# EAGLE design 3wire-1602-panel (EAGLE 5.07)
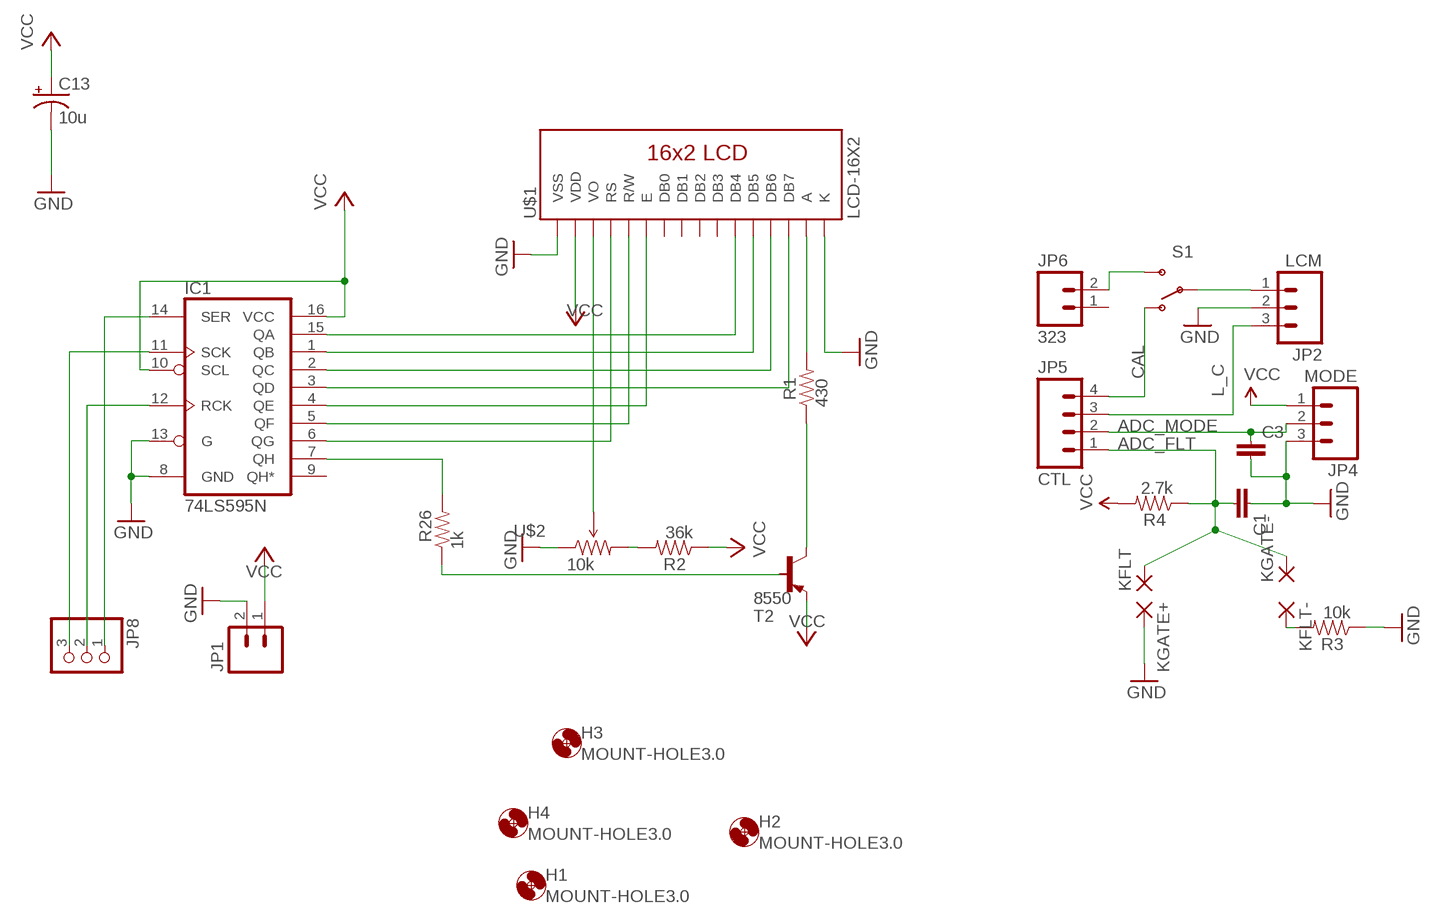
[diagram p0: schematic, sheet 1]

## Parts
C1  CAPPTH1  [CAP-PTH-5MM]
C3  CAPPTH1  [CAP-PTH-5MM]
C13  10u  CAP_POL1206  [EIA3216]
H1  MOUNT-HOLE3.0  [3,0]
H2  MOUNT-HOLE3.0  [3,0]
H3  MOUNT-HOLE3.0  [3,0]
H4  MOUNT-HOLE3.0  [3,0]
IC1  74LS595N  [DIL16]
JP1  CON-02-XH  [XH-1X2-LONG-LOCK]
JP2  LCM  M03LOCK_LONGPADS  [1X03_LOCK_LONGPADS]
JP4  MODE  M03LOCK_LONGPADS  [1X03_LOCK_LONGPADS]
JP5  CTL  M04LOCK_LONGPADS  [1X04_LOCK_LONGPADS]
JP6  323  CON-02LOCK_LONGPADS  [1X02_LOCK_LONGPADS]
JP8  PINHD-1X3/90-LOCK  [1X03/90_LOCK]
KFLT  3,81/1,4  [3,81/1,4]
KFLT-  3,81/1,4  [3,81/1,4]
KGATE+  3,81/1,4  [3,81/1,4]
KGATE-  3,81/1,4  [3,81/1,4]
R1  430  RESISTOR1/4W  [AXIAL-0.3]
R2  36k  RESISTOR1/4W  [AXIAL-0.3]
R3  10k  RESISTOR1/4W  [AXIAL-0.3]
R4  2.7k  RESISTOR1/4W  [AXIAL-0.3]
R26  1k  RESISTOR1/4W  [AXIAL-0.3]
S1  SWITCH-SPST3AM6  [SWITCH-SPDT-AM#6]
T2  8550  -PNP-TO92-EBC  [TO92-EBC]
U$1  LCD-16X2  LCD-16X2-STD  [LCD-16X2]
U$2  10k  TRIMPOTPTH  [TRIM_POT_PTH]

## Nets
ADC_FLT: C1.2 JP5.1 KFLT.1(P) KGATE-.1(P) R4.P$1
ADC_MODE: C3.1 JP4.2 JP5.2
CAL: JP5.4 S1.1(O)
GND: C1.1 C3.2 C13.C(-) IC1.8(GND) IC1.13(G) JP1.2 JP2.2 JP4.3 KGATE+.1(P) R3.P$1 U$1.1(VSS) U$1.16(K) U$2.1(CCW)
L_C: JP2.3 JP5.3
N$1: IC1.15(QA) U$1.11(DB4)
N$2: IC1.1(QB) U$1.12(DB5)
N$3: IC1.2(QC) U$1.13(DB6)
N$4: IC1.3(QD) U$1.14(DB7)
N$5: IC1.4(QE) U$1.6(E)
N$6: IC1.5(QF) U$1.5(R/W)
N$7: IC1.6(QG) U$1.4(RS)
N$8: IC1.7(QH) R26.P$2
N$10: IC1.14(SER) JP8.1
N$11: IC1.11(SCK) JP8.3
N$12: JP2.1 S1.2(P)
N$13: IC1.12(RCK) JP8.2
N$14: JP6.2 S1.3(S)
N$15: U$1.3(VO) U$2.2(WIPER)
N$16: R1.P$2 U$1.15(A)
N$17: R2.P$2 U$2.3(CW)
N$19: R1.P$1 T2.C
N$20: KFLT-.1(P) R3.P$2
N$55: R26.P$1 T2.B
VCC: C13.A(+) IC1.10(SCL) IC1.16(VCC) JP1.1 JP4.1 R2.P$1 R4.P$2 T2.E U$1.2(VDD)
Unconnected: IC1.9(QH*) JP6.1 U$1.7(DB0) U$1.8(DB1) U$1.9(DB2) U$1.10(DB3)

## Library data of the parts
C1 C3 = digital-toy:CAP: Capacitor Standard 0603 ceramic capacitor, and 0.1" leaded capacitor.
C13 = SparkFun:CAP_POL: Capacitor Polarized These are standard SMD and PTH capacitors. Normally 10uF, 47uF, and 100uF in electrolytic and tantalum varieties. Always verify the external diameter of the through hole cap, it varies with capacity, voltage, and manufacturer. The EIA devices should be standard.
H1-H4 = holes:MOUNT-HOLE: MOUNTING HOLE with drill center marker
IC1 = SparkFun:74*595: 8-bit SHIFT REGISTER, output latch
JP1 JP6 = digital-toy:CON-02: Header 2 Standard 2-pin 0.1" header. Use with straight break away headers (SKU : PRT-00116), right angle break away headers (PRT-00553), swiss pins (PRT-00743), machine pins (PRT-00117), and female headers (PRT-00115). Molex polarized connector foot print use with SKU : PRT-08233 with associated crimp pins and housings.
JP2 JP4 = digital-toy:M03: Header 3 Standard 3-pin 0.1" header. Use with straight break away headers (SKU : PRT-00116), right angle break away headers (PRT-00553), swiss pins (PRT-00743), machine pins (PRT-00117), and female headers (PRT-00115). Molex polarized connector foot print use with SKU : PRT-08232 with associated crimp pins and housings.
JP5 = SparkFun:M04: Header 4 Standard 4-pin 0.1" header. Use with straight break away headers (SKU : PRT-00116), right angle break away headers (PRT-00553), swiss pins (PRT-00743), machine pins (PRT-00117), and female headers (PRT-00115). Molex polarized connector foot print use with SKU : PRT-08231 with associated crimp pins and housings. 1MM SMD Version SKU: PRT-10208
JP8 = digital-toy:PINHD-1X3: PIN HEADER
KFLT KFLT- KGATE+ KGATE- = wirepad:3,81/1,4: THROUGH-HOLE PAD
R1-R4 R26 = digital-toy:RESISTOR: Resistor Basic schematic elements and footprints for 0603, 1206, and PTH 1/10th watt (small) resistors. digital-toy copy vertical mount of axial-0.3 from rcl.lbr : the 0207/xx 3W resistor: 0617/17, 0617/22, 0617V
S1 = digital-toy:SWITCH-SPST: SPST Switch Simple slide switch. Spark Fun Electronics SKU : COM-00102
T2 = digital-toy:*-PNP-: PNP Transistror
U$1 = digital-toy:LCD-16X2: LCD 1602 1602 STD standard lcd1602 1602 YHDS buy from taobao: DV162B4 S2FBLY-H-DS by hyl digital-toy
U$2 = SparkFun:TRIMPOT

## Board
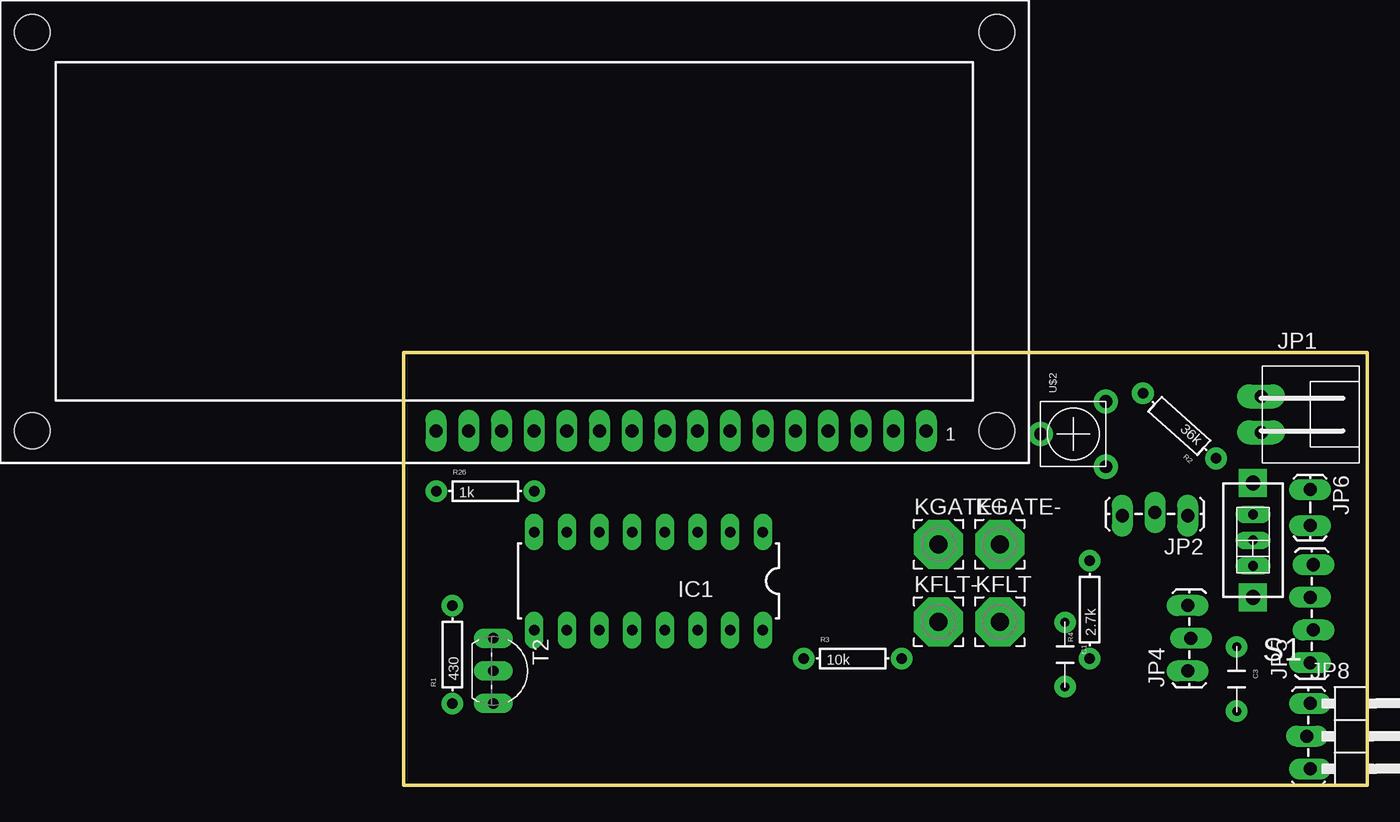
[diagram p1: board, top side]
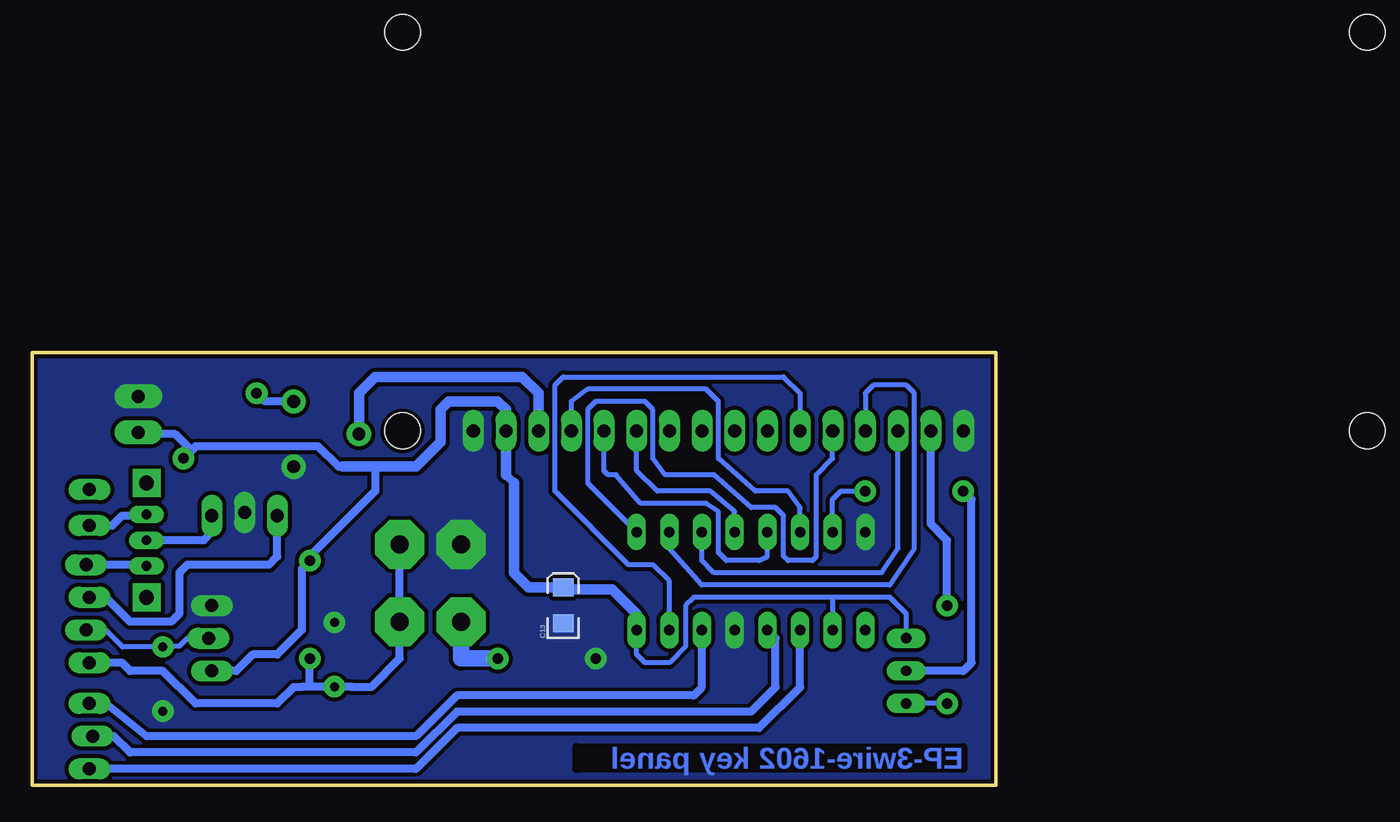
[diagram p2: board, bottom side, seen from below]

Size 74.93 x 33.66 mm. Coordinates in mm from the lower left corner, seen from the top.
Outline: 74.93,0 74.93,33.66 0,33.66 0,0 74.93,0
Copper layers (1*16): Top 0.035mm / dielectric 1.5mm / Bottom 0.035mm
Design rules "SparkFun": minimum track width 8mil, minimum drill 20mil, track to track 8mil, track to pad 8mil, pad to pad 8mil, via to via 8mil, smd to smd 8mil, copper to edge 10mil, drill to drill 8mil, minimum pad ring 12mil, minimum via ring 10mil, stop-mask expansion 4mil, vias tented up to drill 25mil, thermal gap 10mil

### Footprints (pad centres in the part's own frame; a part is rotated, then mirrored left to right if it is on the bottom)
CAP-PTH-5MM = drill 0.7 pad 1.651 round: 1 -2.5,0; 2 2.5,0
EIA3216 = smd 1.4 x 1.6: A 1.4,0; C -1.4,0
3,0 = hole 3: 0,0
DIL16 = drill 0.813 long: 1 -8.89,-3.81; 2 -6.35,-3.81; 3 -3.81,-3.81; 4 -1.27,-3.81; 5 1.27,-3.81; 6 3.81,-3.81; 7 6.35,-3.81; 8 8.89,-3.81; 9 8.89,3.81; 10 6.35,3.81; 11 3.81,3.81; 12 1.27,3.81; 13 -1.27,3.81; 14 -3.81,3.81; 15 -6.35,3.81; 16 -8.89,3.81
XH-1X2-LONG-LOCK = drill 1.016 pad 1.88 long: 1 1.397,0; 2 -1.397,0
1X03_LOCK_LONGPADS = drill 1.016 long: 1 0,0; 2 2.54,-0.254; 3 5.08,0
1X04_LOCK_LONGPADS = drill 1.016 long: 1 0,0; 2 2.54,-0.254; 3 5.08,0; 4 7.62,-0.254
1X02_LOCK_LONGPADS = drill 1.016 long: 1 -0.127,0; 2 2.667,0
1X03/90_LOCK = drill 1.016 long: 1 -2.54,-3.81; 2 0,-4.064; 3 2.54,-3.81
3,81/1,4 = drill 1.397 pad 3.81 octagon: 1 0,0
AXIAL-0.3 = drill 0.813 pad 1.676 round: P$1 -3.81,0; P$2 3.81,0
SWITCH-SPDT-AM#6 = drill 0.762 pad 1.27 long: 1 0,2; 2 0,0; 3 0,-2 | drill 1.15 pad 2.184 square: P$1 0,-4.445; P$2 0,4.445
TO92-EBC = drill 0.813 pad 1.524 long: B 0,-1.27; C 2.54,-1.27; E -2.54,-1.27
LCD-16X2 = drill 1.016 long: 1 -32,15.5; 2 -29.46,15.5; 3 -26.92,15.5; 4 -24.38,15.5; 5 -21.84,15.5; 6 -19.3,15.5; 7 -16.76,15.5; 8 -14.22,15.5; 9 -11.68,15.5; 10 -9.14,15.5; 11 -6.6,15.5; 12 -4.06,15.5; 13 -1.52,15.5; 14 1.02,15.5; 15 3.56,15.5; 16 6.1,15.5 | hole 2.8: -37.5,15.5; -37.5,-15.5; 37.5,15.5; 37.5,-15.5
TRIM_POT_PTH = drill 1 pad 1.88 round: 1 -2.54,-2.54; 2 0,2.54; 3 2.54,-2.54

### Placement (x,y rotation side)
C1  51.44,10.16 270 top
C3  64.77,8.26 270 top
C13  33.66,13.97 90 bottom
H1  0,-20.95 0 top  (outside the outline)
H2  -26.04,-20.95 0 top  (outside the outline)
H3  -17.78,-20.95 0 top  (outside the outline)
H4  -9.53,-20.95 0 top  (outside the outline)
IC1  19.05,15.88 180 top
JP1  66.67,28.83 270 top
JP2  60.96,20.95 180 top
JP4  60.96,8.89 90 top
JP5  70.48,9.53 90 top
JP6  70.48,22.86 270 top
JP8  74.3,3.81 270 top
KFLT  46.35,12.7 0 top
KFLT-  41.59,12.7 0 top
KGATE+  41.59,18.73 0 top
KGATE-  46.35,18.73 0 top
R1  3.81,10.16 90 top
R2  60.33,27.94 138.3 top
R3  34.92,9.84 0 top
R4  53.34,13.65 90 top
R26  6.35,22.86 0 top
S1  66.04,19.05 180 top
T2  8.26,8.89 270 top
U$1  8.64,43.05 180 top
U$2  52.07,27.3 90 top

### Tracks (layer width: path | path; a pad name or v marks a point on that pad's centre or on a via)
ADC_FLT
  Bottom 0.61: 53.34,7.66 C1.2 50.12,7.66 50.09,7.62 48.58,7.62 46.35,9.84 KFLT.1 KGATE-.1 | 53.34,7.66 53.94,7.66 53.98,7.62 54.61,7.62 55.88,6.35 62.23,6.35 64.77,8.89 67.31,8.89 67.94,9.53 JP5.1 | 53.34,7.66 R4.P$1
ADC_MODE
  Bottom 0.406: JP4.2 62.87,11.43 63.5,10.79 64.73,10.79 C3.1 67.91,10.76 69.22,12.06 JP5.2
CAL
  Bottom 0.406: S1.1 66.14,17.14
  Bottom 0.61: 66.14,17.14 JP5.4
GND
  pour Bottom (isolate 0.305, no thermals): -4.45,40.64 62.23,40.64 93.34,37.47 102.23,6.35 81.92,-5.71 -6.99,-6.35 -11.43,-1.91 -11.43,33.66
L_C
  Bottom 0.61: JP5.3 69.22,14.61 67.31,12.7 64.14,12.7 63.5,13.34 63.5,16.51 62.87,17.14 56.52,17.14 55.88,17.78 JP2.3
N$1
  Bottom 0.406: IC1.15 25.4,15.88 26.67,17.14 28.57,17.14 34.29,22.86 34.29,31.11 33.66,31.75 16.51,31.75 15.24,30.48 15.24,28.19 U$1.11
N$2
  Bottom 0.254: 12.7,28.18 U$1.12
  Bottom 0.406: IC1.1 31.75,23.5 31.75,29.21 31.11,29.84 27.3,29.84 26.67,29.21 26.67,25.4 25.72,24.13 21.91,24.13 19.05,21.59 17.14,21.59 16.51,20.95 16.51,17.78 16.19,17.46 14.29,17.46 13.97,17.78 13.97,24.13 12.7,25.4 12.7,28.18
N$3
  Bottom 0.406: IC1.2 25.4,18.41 22.86,15.56 8.26,15.56 6.35,18.41 6.35,30.48 6.99,31.11 9.53,31.11 10.16,30.48 10.16,28.19 U$1.13
N$4
  Bottom 0.406: IC1.3 22.86,17.46 21.91,16.51 8.89,16.51 7.62,18.41 7.62,26.91 U$1.14
N$5
  Bottom 0.406: IC1.4 20.32,21.27 22.23,22.86 26.35,22.86 27.94,24.45 27.94,28.18 U$1.6
N$6
  Bottom 0.406: IC1.5 17.78,17.78 18.41,17.46 20.95,17.46 21.59,18.1 21.59,21.27 22.54,21.91 27.62,21.91 29.53,24.13 30.16,24.13 30.48,24.45 U$1.5
N$7
  Bottom 0.406: IC1.6 15.24,21.59 16.19,22.86 18.73,22.86 21.59,25.4 21.59,29.84 22.54,30.8 31.75,30.8 33.02,29.84 33.02,28.19 U$1.4
N$8
  Bottom 0.406: IC1.7 12.7,22.23 12.06,22.86 R26.P$2
N$10
  Bottom 0.61: JP8.1 69.22,6.35 66.04,3.81 45.09,3.81 41.91,6.99 23.5,6.99 22.86,7.62 IC1.14
N$11
  Bottom 0.61: JP8.3 45.09,1.27 41.91,4.45 18.41,4.45 15.24,7.62 IC1.11
N$12
  Bottom 0.61: JP2.1 60.96,19.68 61.59,19.05 S1.2
N$13
  Bottom 0.61: JP8.2 68.58,3.81 67.31,2.54 45.09,2.54 41.91,5.71 19.05,5.71 17.14,7.62 17.14,11.43 IC1.12
N$14
  Bottom 0.406: 66.14,20.95 S1.3
  Bottom 0.61: JP6.2 68.71,20.19 67.94,20.95 66.14,20.95
N$15
  Bottom 0.813: U$2.2 49.53,30.48 48.26,31.75 36.83,31.75 35.56,30.48 35.56,28.19 U$1.3
N$16
  Bottom 0.254: U$1.15
  Bottom 0.61: R1.P$2 3.81,19.05 5.08,20.32 U$1.15
N$17
  Bottom 0.61: U$2.3 56.85,29.84 R2.P$2
N$19
  Bottom 0.406: R1.P$1 T2.C
N$20
  Bottom 1.27: R3.P$2 41.59,9.84 KFLT-.1
N$55
  Bottom 0.61: T2.B 2.54,8.89 1.91,9.53 1.91,22.23 R26.P$1
VCC
  Bottom 0.406: 12.7,14.61 23.5,14.61 24.13,13.97 24.13,10.79 25.4,9.53 27.3,9.53 27.94,10.16 IC1.16 | T2.E 6.99,13.34 8.26,14.61 12.7,14.61 | 12.7,14.61 IC1.10 | U$1.2 | 66.55,27.3 JP1.1
  Bottom 0.61: 37.47,23.5 38.1,24.13 | JP4.1 59.05,8.89 57.78,10.16 55.88,10.16 53.98,12.06 53.98,16.83 R4.P$2 53.34,17.78 48.26,22.86 48.26,24.77 | 50.8,24.77 51.12,24.77 52.7,26.35 62.22,26.35 62.54,26.03 | 62.54,26.03 R2.P$1 | 66.55,27.3 63.82,27.3 62.54,26.03
  Bottom 0.813: U$1.2 38.1,29.21 38.73,29.84 42.55,29.84 43.18,29.21 43.18,26.67 45.09,24.77 48.26,24.77 50.8,24.77 | 37.47,23.5 37.47,16.51 36.33,15.37 C13.A 33.52,15.24 29.84,15.24 27.94,13.34 IC1.16 | 38.1,24.13 U$1.2

### Text on the board
Bottom: EP-3wire-1602 key panel